# Altium schematic sheet Sheet2.SchDoc
size 304 x 304 mm; SheetNumber: 1; SheetTotal: 1
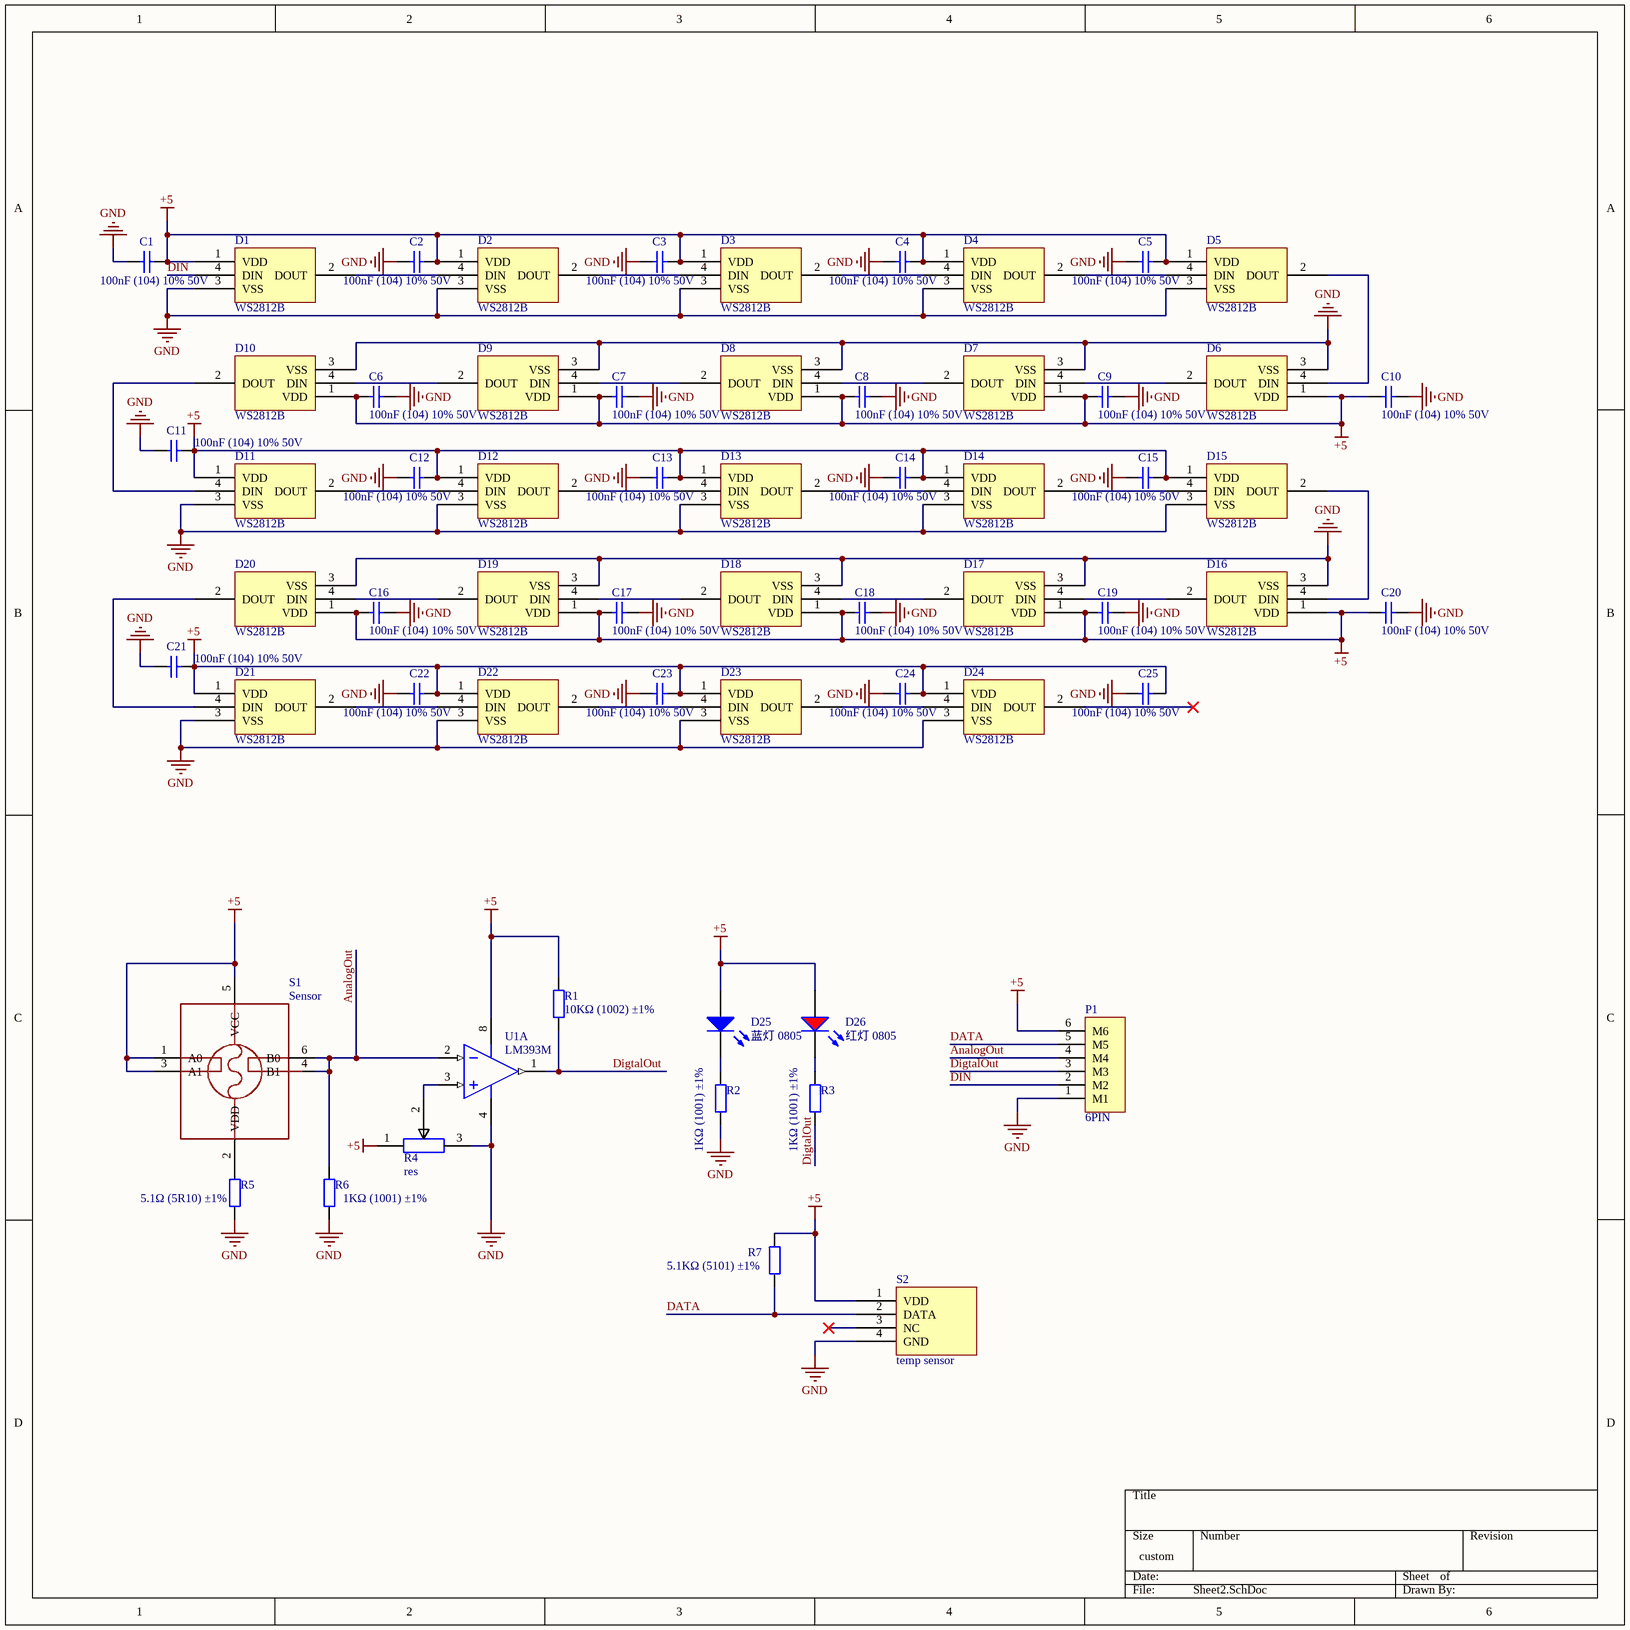
[diagram p0: Sheet2.SchDoc]

## Parts
C1  100nF (104) 10% 50V  [0603_C]
C2  100nF (104) 10% 50V  [0603_C]
C3  100nF (104) 10% 50V  [0603_C]
C4  100nF (104) 10% 50V  [0603_C]
C5  100nF (104) 10% 50V  [0603_C]
C6  100nF (104) 10% 50V  [0603_C]
C7  100nF (104) 10% 50V  [0603_C]
C8  100nF (104) 10% 50V  [0603_C]
C9  100nF (104) 10% 50V  [0603_C]
C10  100nF (104) 10% 50V  [0603_C]
C11  100nF (104) 10% 50V  [0603_C]
C12  100nF (104) 10% 50V  [0603_C]
C13  100nF (104) 10% 50V  [0603_C]
C14  100nF (104) 10% 50V  [0603_C]
C15  100nF (104) 10% 50V  [0603_C]
C16  100nF (104) 10% 50V  [0603_C]
C17  100nF (104) 10% 50V  [0603_C]
C18  100nF (104) 10% 50V  [0603_C]
C19  100nF (104) 10% 50V  [0603_C]
C20  100nF (104) 10% 50V  [0603_C]
C21  100nF (104) 10% 50V  [0603_C]
C22  100nF (104) 10% 50V  [0603_C]
C23  100nF (104) 10% 50V  [0603_C]
C24  100nF (104) 10% 50V  [0603_C]
C25  100nF (104) 10% 50V  [0603_C]
D1  WS2812B  [5050-4PIN-WS2812]
D2  WS2812B  [5050-4PIN-WS2812]
D3  WS2812B  [5050-4PIN-WS2812]
D4  WS2812B  [5050-4PIN-WS2812]
D5  WS2812B  [5050-4PIN-WS2812]
D6  WS2812B  [5050-4PIN-WS2812]
D7  WS2812B  [5050-4PIN-WS2812]
D8  WS2812B  [5050-4PIN-WS2812]
D9  WS2812B  [5050-4PIN-WS2812]
D10  WS2812B  [5050-4PIN-WS2812]
D11  WS2812B  [5050-4PIN-WS2812]
D12  WS2812B  [5050-4PIN-WS2812]
D13  WS2812B  [5050-4PIN-WS2812]
D14  WS2812B  [5050-4PIN-WS2812]
D15  WS2812B  [5050-4PIN-WS2812]
D16  WS2812B  [5050-4PIN-WS2812]
D17  WS2812B  [5050-4PIN-WS2812]
D18  WS2812B  [5050-4PIN-WS2812]
D19  WS2812B  [5050-4PIN-WS2812]
D20  WS2812B  [5050-4PIN-WS2812]
D21  WS2812B  [5050-4PIN-WS2812]
D22  WS2812B  [5050-4PIN-WS2812]
D23  WS2812B  [5050-4PIN-WS2812]
D24  WS2812B  [5050-4PIN-WS2812]
D25  蓝灯 0805  [0805_LED_S1]
D26  红灯 0805  [0805_LED_S1]
P1  6PIN  [接线端子(2.54mm)-6PIN]
R1  10KΩ (1002) ±1%  [0603_R]
R2  1KΩ (1001) ±1%  [0603_R]
R3  1KΩ (1001) ±1%  [0603_R]
R4  res  [ResV]
R5  5.1Ω (5R10) ±1%  [0603_R]
R6  1KΩ (1001) ±1%  [0603_R]
R7  5.1KΩ (5101) ±1%  [0603_R]
S1  Sensor  [SENSOR-TH_MQ-2]
S2  temp sensor  [SENSOR-TH_DHT11]
U1  LM393M  [D0008A_L]  (part A of 2)

## Nets
+5: C1.1 C2.1 C3.1 C4.1 C5.1 C6.2 C7.2 C8.2 C9.2 C10.2 C11.2 C12.2 C13.2 C14.2 C15.2 C16.1 C17.1 C18.1 C19.1 C20.1 C21.2 C22.2 C23.2 C24.2 C25.2 D1.1(VDD) D2.1(VDD) D3.1(VDD) D4.1(VDD) D5.1(VDD) D6.1(VDD) D7.1(VDD) D8.1(VDD) D9.1(VDD) D10.1(VDD) D11.1(VDD) D12.1(VDD) D13.1(VDD) D14.1(VDD) D15.1(VDD) D16.1(VDD) D17.1(VDD) D18.1(VDD) D19.1(VDD) D20.1(VDD) D21.1(VDD) D22.1(VDD) D23.1(VDD) D24.1(VDD) D25.A D26.A P1.6(M6) R1.2 R4.1 R7.2 S1.1(A0) S1.3(A1) S1.5(VCC) S2.1(VDD) U1.8(V+)
GND: C1.2 C2.2 C3.2 C4.2 C5.2 C6.1 C7.1 C8.1 C9.1 C10.1 C11.1 C12.1 C13.1 C14.1 C15.1 C16.2 C17.2 C18.2 C19.2 C20.2 C21.1 C22.1 C23.1 C24.1 C25.1 D1.3(VSS) D2.3(VSS) D3.3(VSS) D4.3(VSS) D5.3(VSS) D6.3(VSS) D7.3(VSS) D8.3(VSS) D9.3(VSS) D10.3(VSS) D11.3(VSS) D12.3(VSS) D13.3(VSS) D14.3(VSS) D15.3(VSS) D16.3(VSS) D17.3(VSS) D18.3(VSS) D19.3(VSS) D20.3(VSS) D21.3(VSS) D22.3(VSS) D23.3(VSS) D24.3(VSS) P1.1(M1) R2.2 R4.3 R5.2 R6.1 S2.4(GND) U1.4(GND)
AnalogOut: P1.4(M4) R6.2 S1.4(B1) S1.6(B0) U1.2(INA-)
DATA: P1.5(M5) R7.1 S2.2(DATA)
DigtalOut: P1.3(M3) R1.1 R3.2 U1.1(OUTA)
DIN: D1.4(DIN) P1.2(M2)
NetD1_2: D1.2(DOUT) D2.4(DIN)
NetD2_2: D2.2(DOUT) D3.4(DIN)
NetD3_2: D3.2(DOUT) D4.4(DIN)
NetD4_2: D4.2(DOUT) D5.4(DIN)
NetD5_2: D5.2(DOUT) D6.4(DIN)
NetD6_2: D6.2(DOUT) D7.4(DIN)
NetD7_2: D7.2(DOUT) D8.4(DIN)
NetD8_2: D8.2(DOUT) D9.4(DIN)
NetD9_2: D9.2(DOUT) D10.4(DIN)
NetD10_2: D10.2(DOUT) D11.4(DIN)
NetD11_2: D11.2(DOUT) D12.4(DIN)
NetD12_2: D12.2(DOUT) D13.4(DIN)
NetD13_2: D13.2(DOUT) D14.4(DIN)
NetD14_2: D14.2(DOUT) D15.4(DIN)
NetD15_2: D15.2(DOUT) D16.4(DIN)
NetD16_2: D16.2(DOUT) D17.4(DIN)
NetD17_2: D17.2(DOUT) D18.4(DIN)
NetD18_2: D18.2(DOUT) D19.4(DIN)
NetD19_2: D19.2(DOUT) D20.4(DIN)
NetD20_2: D20.2(DOUT) D21.4(DIN)
NetD21_2: D21.2(DOUT) D22.4(DIN)
NetD22_2: D22.2(DOUT) D23.4(DIN)
NetD23_2: D23.2(DOUT) D24.4(DIN)
NetD25_K: D25.K R2.1
NetD26_K: D26.K R3.1
NetR4_2: R4.2 U1.3(INA+)
NetR5_1: R5.1 S1.2(VDD)

Not connected (* = marked no-connect by the designer): D24 2(DOUT)*; S2 3(NC)*

## Library data of the parts
C1-C25 = 0603 100nF (104) 10% 50V: 贴片电容; ComponentLink1Description: 供应商链接; ComponentLink1URL: http://www.szlcsc.com/product/details_15331.html; Package: 0603; Supplier: LC; SuppliersPartNumber: C14663
D1-D24 = WS2812B: RGB LED IC
D25 = 0805 蓝灯: 发光二极管; ComponentLink1Description: 供应商链接; ComponentLink1URL: http://www.szlcsc.com/product/details_2666.html; Package: 0805; Supplier: LC; SuppliersPartNumber: C2293
D26 = 0805 红灯: 发光二极管; ComponentLink1Description: 供应商链接; ComponentLink1URL: http://www.szlcsc.com/product/details_2668.html; Package: 0805; Supplier: LC; SuppliersPartNumber: C2295
P1 = 接线端子-6PIN
R1 = 0603 10KΩ (1002) 1%: 贴片电阻; ComponentLink1Description: 供应商链接; ComponentLink1URL: http://www.szlcsc.com/product/details_26547.html; Package: 0603; Supplier: LC; SuppliersPartNumber: C25804
R2 R3 R6 = 0603 1KΩ (1001) 1%: 贴片电阻; ComponentLink1Description: 供应商链接; ComponentLink1URL: http://www.szlcsc.com/product/details_21904.html; Package: 0603; Supplier: LC; SuppliersPartNumber: C21190
R4 = RESV-10K
R5 = 0603 5.1Ω (5R10) 1%: 贴片电阻; ComponentLink1Description: 供应商链接; ComponentLink1URL: http://www.szlcsc.com/product/details_25940.html; Package: 0603; Supplier: LC; SuppliersPartNumber: C25197
R7 = 0603 5.1KΩ (5101) 1%: 贴片电阻; ComponentLink1Description: 供应商链接; ComponentLink1URL: http://www.szlcsc.com/product/details_23913.html; Package: 0603; Supplier: LC; SuppliersPartNumber: C23186
S1 = MQ-2
S2 = DHT11
U1 = CMP-0055-00682-3: Low Power Low Offset Voltage Dual Comparator, 8-pin Narrow SOIC; Manufacturer: Texas Instruments; CompType: Amplifiers; PowerWise: N; PackageTopMarking: NSZXTT*LM*393M; PinCount: 8; Code_IPC: SOIC127P600-8; RoHS: N; PackageDescription: SOIC Narrow, 4.9 x 3.9 x 1.45mm, 8 Lead, 1.27mm Pitch; ComponentLink1URL: http://www.ti.com/general/docs/lit/getliterature.tsp?genericPartNumber=LM393-N&fileType=pdf; Code_JEDEC: MS-012-AA; ComponentLink1Description: Datasheet URL; Package Reference: D0008A